# EAGLE design blink1mk3_005t6_5050_4l_usbc (EAGLE 9.5.0)
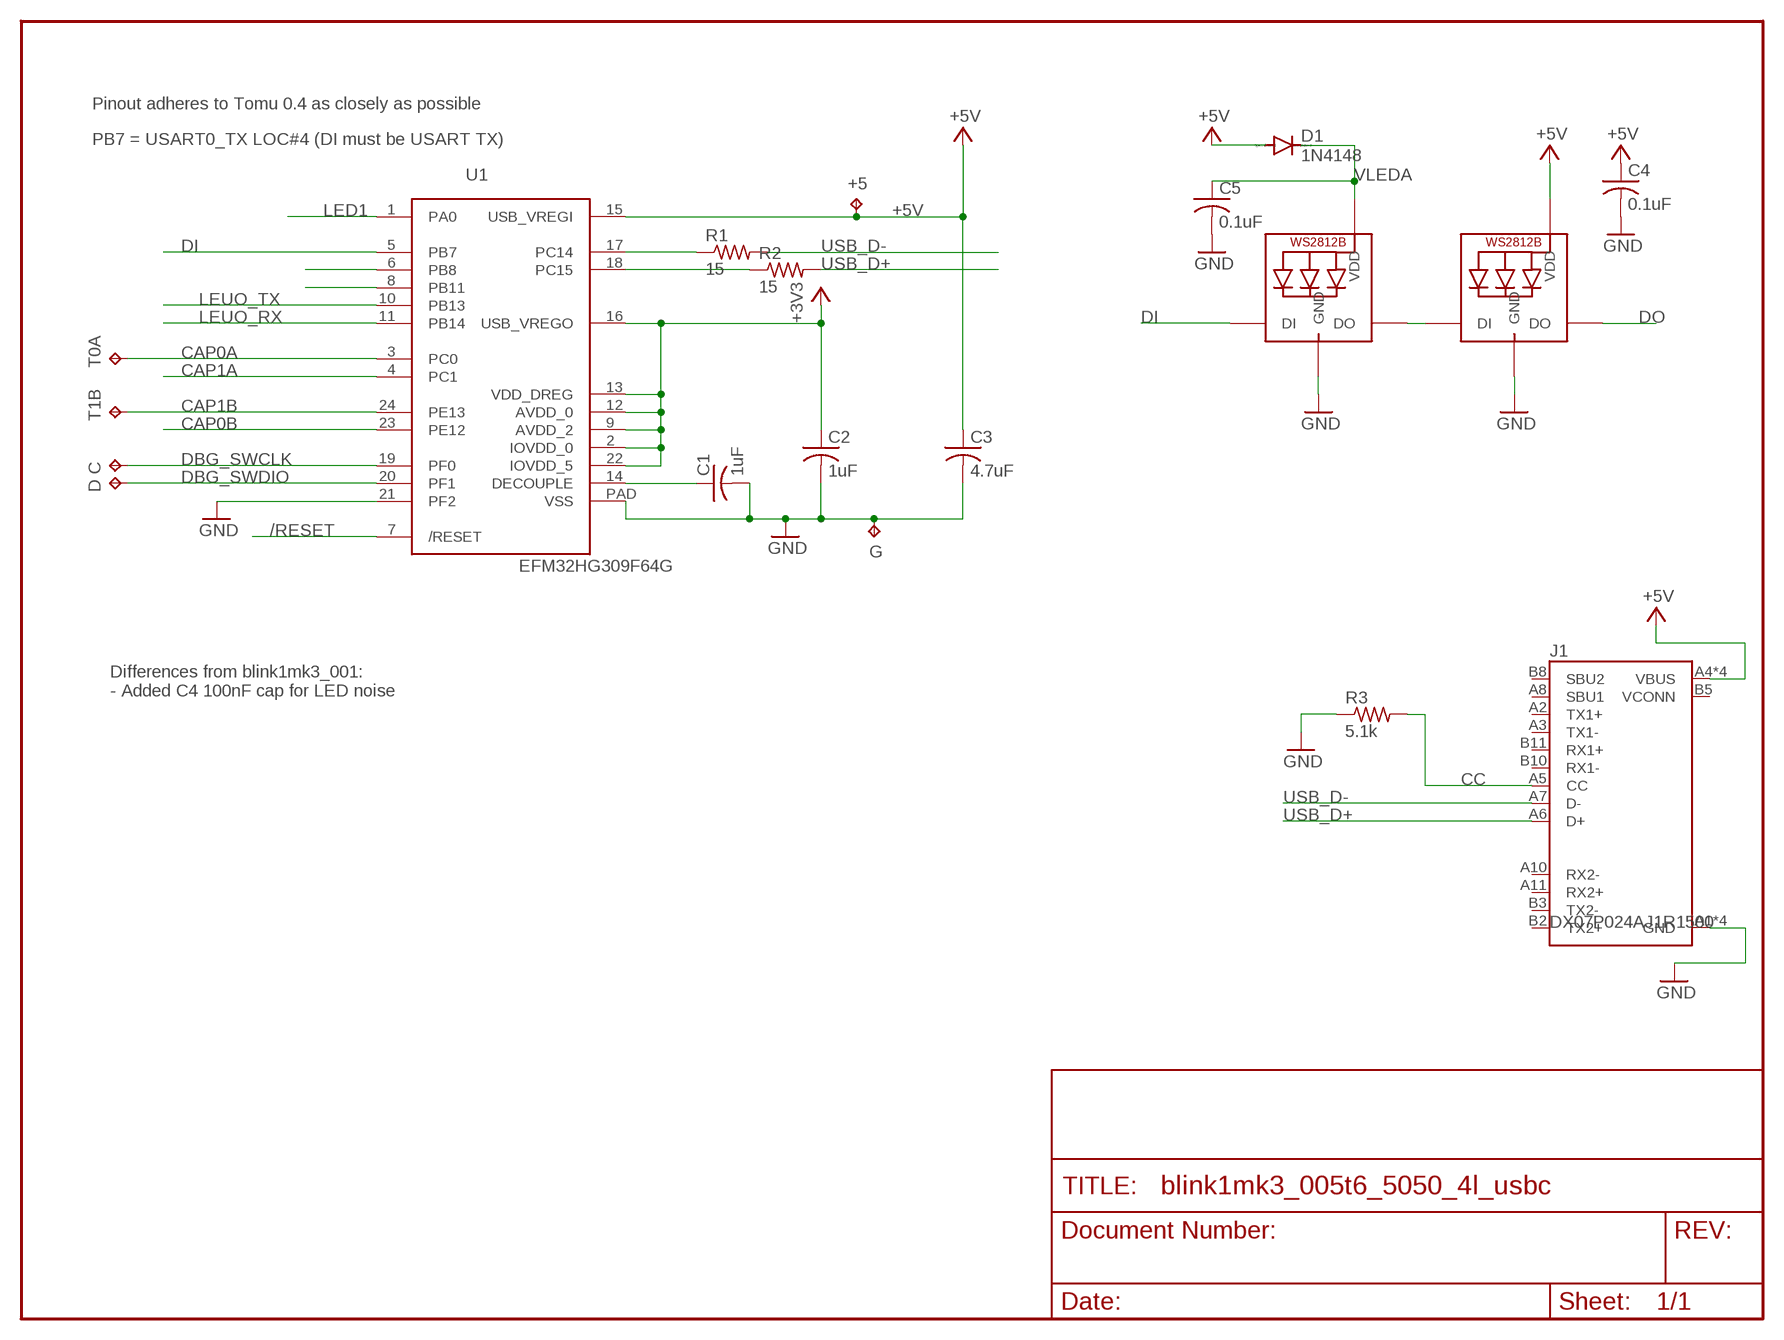
[diagram p0: schematic, sheet 1]

## Parts
+5  TPTP10R  [TP10R]
C  TPTP10R  [TP10R]
C1  1uF  C-USC0402  [C0402]
C2  1uF  C-USC0402  [C0402]
C3  4.7uF  C-USC0402  [C0402]
C4  0.1uF  C-USC0402  [C0402]
C5  0.1uF  C-USC0402  [C0402]
D  TPTP10R  [TP10R]
D1  1N4148  DIODE-SOD523  [SOD523]
G  TPTP10R  [TP10R]
J1  DX07P024AJ1R1500  [JAE_DX07P024AJ1R1500]
LED1  SK6812MINI  WS2812B3535  [LED3535]
LED2  SK6812MINI  WS2812B3535  [LED3535]
R1  15  R-US_R0402  [R0402]
R2  15  R-US_R0402  [R0402]
R3  5.1k  R-US_R0402  [R0402]
T0A  TPTP15R  [TP15R]
T1B  TPTP15R  [TP15R]
U1  EFM32HG309F64G  [QFN24PAD]

## Nets
+3V3: C2.1 U1.2(IOVDD_0) U1.9(AVDD_2) U1.12(AVDD_0) U1.13(VDD_DREG) U1.16(USB_VREGO) U1.22(IOVDD_5)
+5V: +5.TP C3.1 C4.1 D1.A J1.A4(VBUS) J1.A9(VBUS) J1.B4(VBUS) J1.B9(VBUS) LED2.2(VDD) U1.15(USB_VREGI)
/RESET: U1.7(/RESET)
CAP0A: T0A.TP U1.3(PC0)
CAP0B: U1.23(PE12)
CAP1A: U1.4(PC1)
CAP1B: T1B.TP U1.24(PE13)
CC: J1.A5(CC) R3.2
DBG_SWCLK: C.TP U1.19(PF0)
DBG_SWDIO: D.TP U1.20(PF1)
DECOUPLE: C1.1 U1.14(DECOUPLE)
DI: LED1.1(DI) U1.5(PB7)
DO: LED2.3(DO)
GND: C1.2 C2.2 C3.2 C4.2 C5.2 G.TP J1.A1(GND) J1.A12(GND) J1.B1(GND) J1.B12(GND) LED1.4(GND) LED2.4(GND) R3.1 U1.21(PF2) U1.PAD(VSS)
LED1: U1.1(PA0)
LEUO_RX: U1.11(PB14)
LEUO_TX: U1.10(PB13)
N$1: U1.8(PB11)
N$2: LED1.3(DO) LED2.1(DI)
N$3: U1.6(PB8)
RUSB_D+: R2.1 U1.18(PC15)
RUSB_D-: R1.1 U1.17(PC14)
USB_D+: J1.A6(D+) R2.2
USB_D-: J1.A7(D-) R1.2
VLEDA: C5.1 D1.C LED1.2(VDD)
Unconnected: J1.A2(TX1+) J1.A3(TX1-) J1.A8(SBU1) J1.A10(RX2-) J1.A11(RX2+) J1.B2(TX2+) J1.B3(TX2-) J1.B8(SBU2) J1.B10(RX1-) J1.B11(RX1+)

## Notes on the sheet
- Pinout adheres to Tomu 0.4 as closely as possible
- PB7 = USART0_TX LOC#4 (DI must be USART TX)
- Differences from blink1mk3_001:
  - Added C4 100nF cap for LED noise

## Power pins joined to a net without a drawn wire
VCONN: J1.B5(VCONN)

## Library data of the parts
+5 C D G T0A T1B = testpad:TP: Test pad
C1-C5 = adafruit:C-US: CAPACITOR, American symbol
D1 = diode:DIODE-: DIODE
J1 = DX07P024AJ1R1500:DX07P024AJ1R1500: Cut Tape - Usb Type c Slim Plug; DESCRIPTION: Cut Tape - Usb Type c Slim Plug; DIGI-KEY_PART_NUMBER: 670-2868-1-ND; DIGI-KEY_PURCHASE_URL: https://www.digikey.com/product-detail/en/jae-electronics/DX07P024AJ1R1500/670-2868-1-ND/6003057?utm_source=snapeda&utm_medium=aggregator&utm_campaign=symbol; MF: JAE Electronics; MP: DX07P024AJ1R1500; PACKAGE: None
LED1 LED2 = adafruit:WS2812B
R1 R2 = rcl:R-US_: RESISTOR, American symbol; SPICEPREFIX: R
R3 = adafruit:R-US_: RESISTOR, American symbol
U1 = todstuff:EFM32HG309F64G

## Board
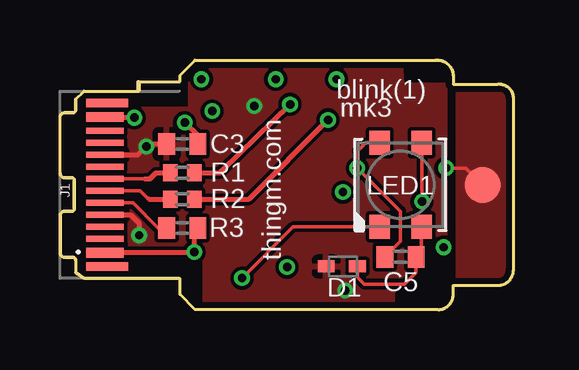
[diagram p1: board, top side]
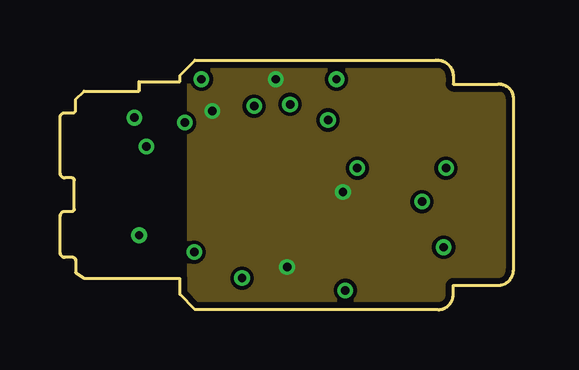
[diagram p2: board, inner layer Route2]
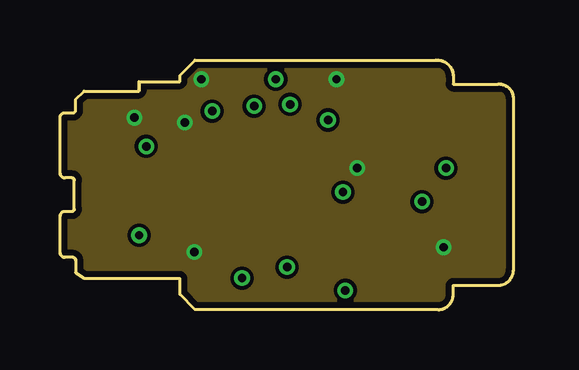
[diagram p3: board, inner layer Route15]
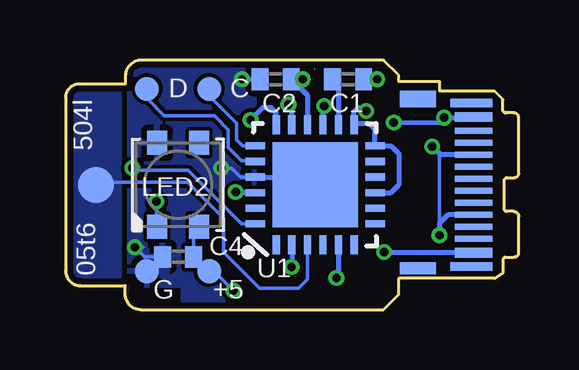
[diagram p4: board, bottom side, seen from below]

Size 18.9 x 10.4 mm. Coordinates in mm from the lower left corner, seen from the top.
Outline: 3.3,9.5 5,9.5 5,9.77 5.63,10.4 15.66,10.4 arc-90 16.4,9.77 16.4,9.4 18.26,9.4 arc-90 18.9,8.87 18.9,1.64 arc-90 18.26,1 16.4,1 16.4,0.63 arc-90 15.77,0 5.63,0 5,0.63 5,1.3 1,1.3 0.65,1.54 0.65,2.05 arc90 0.55,2.18 0.2,2.18 arc-90 0,2.38 0,3.89 arc-90 0.2,4.09 0.5,4.09 arc90 0.6,4.19 0.6,5.39 arc90 0.5,5.49 0.2,5.49 arc-90 0,5.69 0,8 arc-90 0.2,8.2 0.5,8.2 arc90 0.65,8.28 0.65,8.76 1,9.1 3.3,9.1 3.3,9.5
Copper layers (1+2*15+16): Top 0.035mm / dielectric 0.2mm / Route2 0.0175mm / dielectric 0.295mm / Route15 0.0175mm / dielectric 0.2mm / Bottom 0.035mm
Design rules "SeeedStudio_2layer_DRU_no_angle_20140221 *": minimum track width 6mil, minimum drill 12mil, track to track 6mil, track to pad 6mil, pad to pad 6mil, via to via 6mil, smd to smd 0mil, copper to edge 10mil, drill to drill 10mil, minimum pad ring 10mil, minimum via ring 6mil, stop-mask expansion 2mil, vias tented up to drill 100mil, thermal gap 10mil

### Footprints (pad centres in the part's own frame; a part is rotated, then mirrored left to right if it is on the bottom)
TP10R = smd 1 x 1: TP 0,0
C0402 = smd 0.7 x 0.9: 1 -0.65,0; 2 0.65,0
SOD523 = smd 0.7 x 0.5: A 0.7,0; C -0.6,0
JAE_DX07P024AJ1R1500 = smd 0.36 x 1.75: 13 -3.405,1.975; 14 3.405,1.975 | smd 0.36 x 1.75 bottom: 15 -3.405,1.975; 16 3.405,1.975 | smd 0.7 x 1.5 bottom: 17 -3.575,4.2 | smd 0.5 x 1.5 bottom: 18 3.475,4.2 | smd 0.41 x 1.55: A1 2.825,1.875; A12 -2.825,1.875 | smd 0.26 x 1.55: A2 2.25,1.875; A3 1.75,1.875; A4 1.25,1.875; A5 0.75,1.875; A6 0.25,1.875; A7 -0.25,1.875; A8 -0.75,1.875; A9 -1.25,1.875; A10 -1.75,1.875; A11 -2.25,1.875 | smd 0.41 x 1.55 bottom: B1 -2.825,1.875; B12 2.825,1.875 | smd 0.26 x 1.55 bottom: B2 -2.25,1.875; B3 -1.75,1.875; B4 -1.25,1.875; B5 -0.75,1.875; B6 -0.25,1.875; B7 0.25,1.875; B8 0.75,1.875; B9 1.25,1.875; B10 1.75,1.875; B11 2.25,1.875
LED3535 = smd 1 x 0.85: 1 -1.75,0.875; 2 -1.75,-0.875; 3 1.75,-0.875; 4 1.75,0.875
R0402 = smd 0.6 x 0.7: 1 -0.5,0; 2 0.5,0
R0402' = smd 0.7 x 0.9: 1 -0.65,0; 2 0.65,0
TP15R = smd 1.5 x 1.5: TP 0,0
QFN24PAD = smd 0.8 x 0.3: 1 -2.5,1.625; 2 -2.5,0.975; 3 -2.5,0.325; 4 -2.5,-0.325; 5 -2.5,-0.975; 6 -2.5,-1.625; 13 2.5,-1.625; 14 2.5,-0.975; 15 2.5,-0.325; 16 2.5,0.325; 17 2.5,0.975; 18 2.5,1.625 | smd 0.3 x 0.8: 7 -1.625,-2.5; 8 -0.975,-2.5; 9 -0.325,-2.5; 10 0.325,-2.5; 11 0.975,-2.5; 12 1.625,-2.5; 19 1.625,2.5; 20 0.975,2.5; 21 0.325,2.5; 22 -0.325,2.5; 23 -0.975,2.5; 24 -1.625,2.5 | smd 3.55 x 3.55: PAD 0,0

### Placement (x,y rotation side)
+5  12.9,1.6 0 bottom
C  12.9,9.2 0 bottom
C1  7.11,9.6 0 bottom
C2  10.13,9.6 180 bottom
C3  5.1,6.9 0 top
C4  14.2,2.2 180 bottom
C5  14.2,2.2 180 top
D  15.5,9.2 0 bottom
D1  11.8,1.8 180 top
G  15.5,1.6 180 bottom
J1  0,5.2 270 top
LED1  14.2,5.2 90 top
LED2  14.2,5.2 90 bottom
R1  5.1,5.7 180 top
R2  5.1,4.6 180 top
R3  5.1k  [R0402']  5.1,3.4 180 top
T0A  17.63,5.2 0 bottom
T1B  17.63,5.2 0 top
U1  8.48,5.2 90 bottom

### Tracks (layer width: path | path; a pad name or v marks a point on that pad's centre or on a via)
+3V3  (via drill 0.35)
  Bottom 0.152: C2.1 v9,9.6
  Bottom 0.203: U1.2 9.46,1.79 v9.47,1.77 | U1.22 11.77,4.88 v11.8,4.9 | U1.16 8.81,8.93 C2.1 | v6.35,8.28 6.48,8.4 6.7,8.4 6.86,8.24 U1.13 6.82,7.74 6.2,7.74 5.98,7.53 U1.12 5.33,6.83 5,6.5 5,5.2 5.33,4.88 U1.9
  pour Route2: 5.4,12.31 18.9,12.31 18.9,-2.29 5.4,-2.29
+5V  (via drill 0.35)
  Top 0.2: J1.A4 2.95,3.95 3.3,3.6 v3.3,3.1
  Top 0.203: J1.A9 3.25,6.45 v3.6,6.8 3.7,6.9 C3.1 4.45,7.16
  Bottom 0.152: LED2.2 13.55,3.23 C4.1 13.5,2.2 +5.TP 12.7,1.6 v11.9,0.8 | v3.3,3.1 3.3,6.5 v3.6,6.8
  Bottom 0.2: J1.A4 2.95,3.95 3.3,3.6 v3.3,3.1
  Bottom 0.203: U1.15 8.16,8.43 v8.1,8.48 | J1.A9 3.25,6.45 v3.6,6.8
  pour Top: 2.9,2.5 2.7,8.4 5.4,8.4 5.4,10.9 14.2,10.9 14.3,9.4 16.1,9.4 16.1,0.9 13.9,0.9 13.91,0 6,0 6,2.5
CAP0A
  Bottom 0.152: T0A.TP 17.53,5.3 13.8,5.3 12.3,3.8 12.3,2.4 10.8,0.9 9.17,0.9 8.81,1.27 U1.3
  pour Bottom (no thermals): 16.61,10 18.9,10 18.9,0.88 16.61,0.88
CAP1B  (via drill 0.35)
  Top 0.152: v16.1,5.9 16.93,5.9 T1B.TP
  Bottom 0.152: U1.24 11.54,3.58 13.77,5.8 16,5.8 v16.1,5.9
  pour Top (no thermals): 16.61,10.02 18.9,10.02 18.9,0.75 16.61,0.75
CC
  Top 0.152: R3.2 4.1,3.4 3.05,4.45 J1.A5
DBG_SWCLK
  Bottom 0.152: U1.19 11.5,6.83 11.76,7.08 11.76,7.77 12.9,8.91 C.TP
DBG_SWDIO
  Bottom 0.152: D.TP 15.5,8.8 14.77,8.07 12.68,8.07 12.11,7.5 12.11,6.77 11.55,6.2 11.01,6.2 U1.20
DECOUPLE
  Bottom 0.203: U1.14 7.51,9.56 7.55,9.6 C1.1
DI  (via drill 0.35)
  Top 0.152: v7.59,1.32 9.73,3.45 LED1.1
  Bottom 0.152: 7.59,1.39 v7.59,1.32
  Bottom 0.203: U1.5 7.51,1.48 7.59,1.39
GND  (via drill 0.35)
  Top 0.152: 13.32,6.83 LED1.4 12.75,6.95 12.4,6.6 v12.4,5.9 14.2,4.1 14.2,2.85 C5.2
  Top 0.203: J1.A12 3.07,8.03 v3.1,8 | J1.B12 5.58,2.38 v5.6,2.4 5.6,3.25 R3.1 | C3.2 5.75,7.25 v5.2,7.79
  Bottom 0.152: v11.53,9.6 C2.2 | 11.06,5.6 U1.21 11.6,5.53 11.98,5.9 v12.4,5.9 | 15.65,2.6 v16,2.6 15.6,2.2 C4.2 14.9,2.2 G.TP
  Bottom 0.203: U1.21 8.81,5.53 U1.PAD | J1.A12 1.9,8 v3.1,8 3.29,7.8 v5.2,7.79 | J1.B12 5.58,2.38 v5.6,2.4 | C1.2 v5.9,9.6
  pour Bottom: 11.02,10.56 11.02,-0.23 13.97,-0.23 13.97,0.99 16.23,0.99 16.23,10.56
  pour Route15: -0.31,12.31 18.77,12.31 18.77,-2.42 -0.31,-2.42
N$2  (via drill 0.35)
  Top 0.152: LED1.3 15.1,6.93 v15.1,4.5
  Bottom 0.152: v15.1,4.5 15.1,3.48 LED2.1
RUSB_D+  (via drill 0.35)
  Top 0.203: v11.18,7.9 7.88,4.6 R2.1
  Bottom 0.203: v11.18,7.9 10.66,8.42 10.32,8.42 10.11,8.21 U1.18
RUSB_D-  (via drill 0.35)
  Top 0.203: v9.6,8.55 6.76,5.8 6.66,5.7 R1.1
  Bottom 0.203: U1.17 9.46,8.41 v9.6,8.55
USB_D+
  Top 0.152: 3.7,4.6 3.35,4.95 J1.A6
  Top 0.203: 3.7,4.6 R2.2
USB_D-
  Top 0.152: J1.A7 3.55,5.45
  Top 0.203: 3.55,5.45 3.75,5.45 4,5.7 R1.2
VLEDA
  Top 0.152: LED1.2 15.07,2.43 C5.1 14.85,1.55 14.37,1.06 12.69,1.06 12.4,1.35 D1.C

### Text on the board
tPlace: blink(1) | mk3 | thingm.com
bPlace: 504l | 05t6